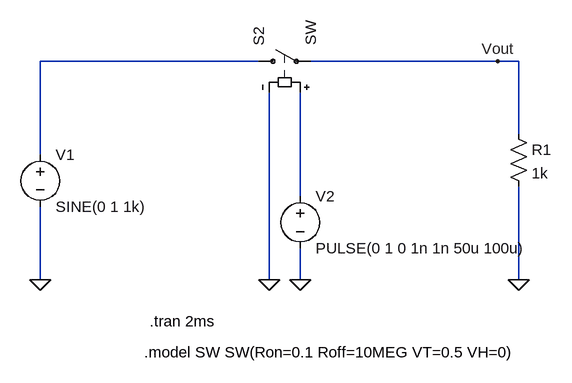
[diagram p0: schematic Switched-based mixer.asc]
Switched-based mixer.asc, the LTspice schematic file:
Version 4
SHEET 1 880 680
WIRE 336 80 0 80
WIRE 704 80 416 80
WIRE 736 80 704 80
WIRE 736 192 736 80
WIRE 0 224 0 80
WIRE 400 288 400 128
WIRE 0 416 0 304
WIRE 352 416 352 128
WIRE 400 416 400 368
WIRE 736 416 736 272
FLAG 0 416 0
FLAG 400 416 0
FLAG 736 416 0
FLAG 352 416 0
FLAG 704 80 Vout
SYMBOL sw 320 80 R270
SYMATTR InstName S2
SYMBOL voltage 0 208 R0
WINDOW 123 0 0 Left 0
WINDOW 39 0 0 Left 0
SYMATTR InstName V1
SYMATTR Value SINE(0 1 1k)
SYMBOL voltage 400 272 R0
WINDOW 123 0 0 Left 0
WINDOW 39 0 0 Left 0
SYMATTR InstName V2
SYMATTR Value PULSE(0 1 0 1n 1n 50u 100u)
SYMBOL res 720 176 R0
SYMATTR InstName R1
SYMATTR Value 1k
TEXT 168 480 Left 2 !.tran 2ms
TEXT 160 528 Left 2 !.model SW SW(Ron=0.1 Roff=10MEG VT=0.5 VH=0)

The netlist it stands for:
* Switched-based mixer.asc
S2 N001 Vout N002 0 SW
V1 N001 0 SINE(0 1 1k)
V2 N002 0 PULSE(0 1 0 1n 1n 50u 100u)
R1 Vout 0 1k
.tran 2ms
.model SW SW(Ron=0.1 Roff=10MEG VT=0.5 VH=0)
.backanno
.end